# EAGLE schematic Quadcopter_shield (EAGLE 7.3.0)
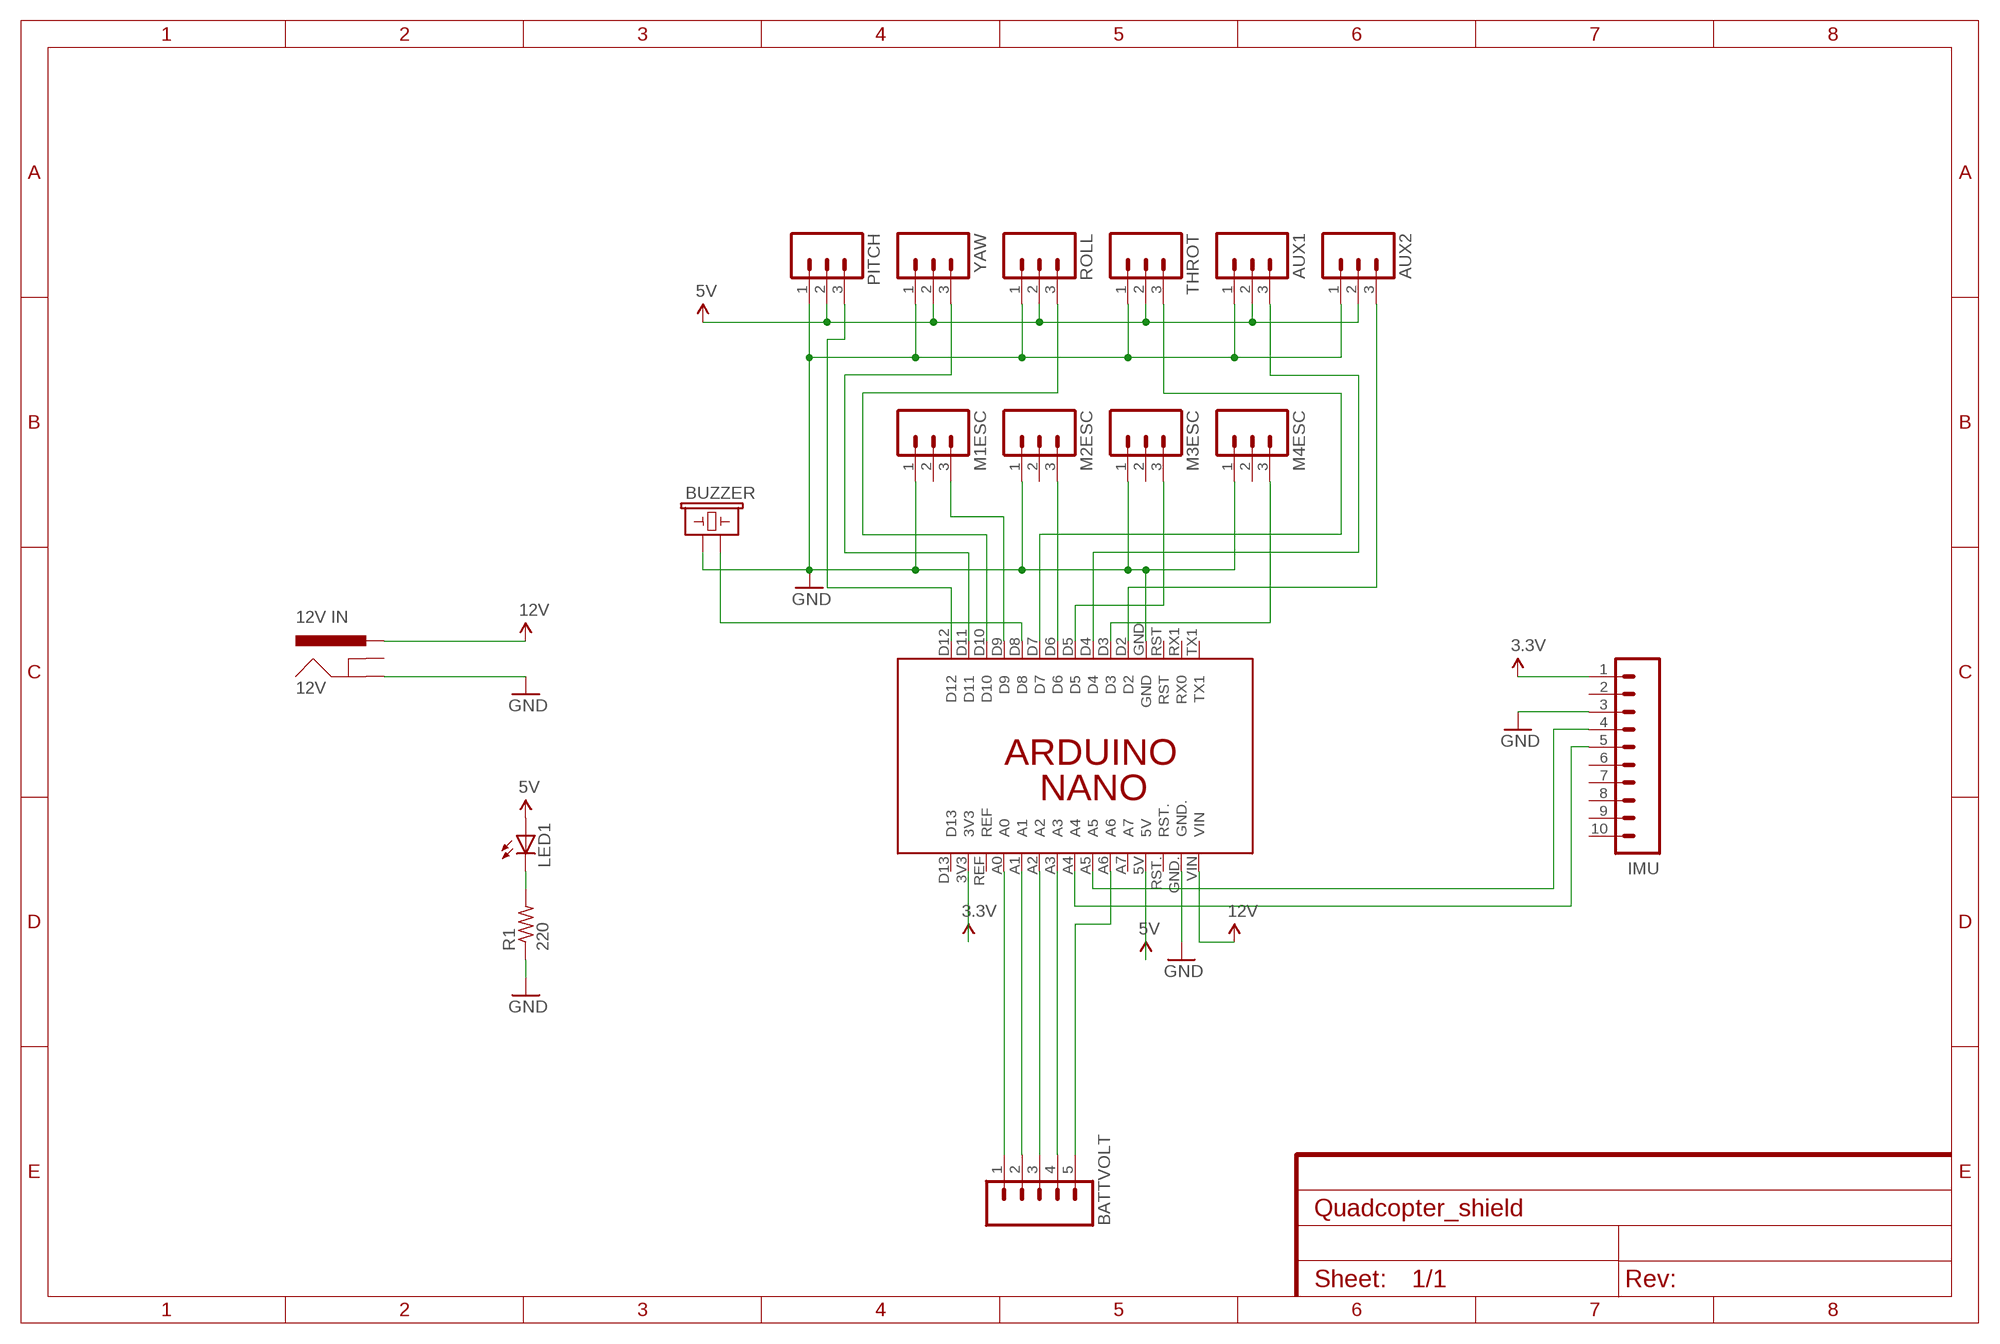
[diagram p0: schematic, sheet 1]

## Parts
12V  12V IN  POWER_JACKPTH_LOCK  [POWER_JACK_PTH_LOCK]
AUX1  M03PTH  [1X03]
AUX2  M03PTH  [1X03]
BATTVOLT  M05PTH  [1X05]
BUZZER  BUZZERNS  [BUZZER-12MM-NS]
IMU  M10SILK_FEMALE_PTH  [1X10]
LED1  TLLR4400  [LED3MM]
M1ESC  M03PTH  [1X03]
M2ESC  M03PTH  [1X03]
M3ESC  M03PTH  [1X03]
M4ESC  M03PTH  [1X03]
PCB1  ARDUINO_NANO  [ARDUINO_NANO]
PITCH  M03PTH  [1X03]
R1  220  R-US_0411/3V  [0411V]
ROLL  M03PTH  [1X03]
THROT  M03PTH  [1X03]
YAW  M03PTH  [1X03]

## Nets
3.3V: IMU.1 PCB1.3V3
5V: AUX1.2 AUX2.2 LED1.A PCB1.5V PITCH.2 ROLL.2 THROT.2 YAW.2
12V: 12V.PWR PCB1.VIN
GND: 12V.GND AUX1.1 AUX2.1 BUZZER.+ IMU.3 M1ESC.1 M2ESC.1 M3ESC.1 M4ESC.1 PCB1.GND PCB1.GND. PITCH.1 R1.1 ROLL.1 THROT.1 YAW.1
N$1: M4ESC.3 PCB1.D3
N$2: M3ESC.3 PCB1.D5
N$3: M2ESC.3 PCB1.D6
N$4: M1ESC.3 PCB1.D9
N$5: IMU.4 PCB1.A5
N$6: IMU.5 PCB1.A4
N$7: BATTVOLT.4 PCB1.A3
N$8: BATTVOLT.3 PCB1.A2
N$9: BATTVOLT.2 PCB1.A1
N$10: BATTVOLT.1 PCB1.A0
N$11: BATTVOLT.5 PCB1.A6
N$12: BUZZER.- PCB1.D8
N$13: AUX2.3 PCB1.D2
N$14: AUX1.3 PCB1.D4
N$15: PCB1.D7 THROT.3
N$16: PCB1.D10 ROLL.3
N$17: PCB1.D11 YAW.3
N$18: PCB1.D12 PITCH.3
N$19: LED1.K(C) R1.2
Unconnected: 12V.GNDBREAK IMU.2 IMU.6 IMU.7 IMU.8 IMU.9 IMU.10 M1ESC.2 M2ESC.2 M3ESC.2 M4ESC.2 PCB1.A7 PCB1.D13 PCB1.REF PCB1.RST PCB1.RST. PCB1.RX1(RX0) PCB1.TX1

## Library data of the parts
12V = SparkFun-Connectors:POWER_JACK: Power Jack This is the standard 5.5mm barrel jack for power. The PTH is the most common, proven, reliable, footprint. The Slot footprint only works if the mill layer is transmitted to the PCB fab house so be warned. Mating wall wart : TOL-00298 (and others); PROD_ID: CONN-08197; SF_ID: PRT-00119
AUX1 AUX2 M1ESC M2ESC M3ESC M4ESC PITCH ROLL THROT YAW = SparkFun-Connectors:M03: Header 3 Standard 3-pin 0.1" header. Use with straight break away headers (SKU : PRT-00116), right angle break away headers (PRT-00553), swiss pins (PRT-00743), machine pins (PRT-00117), and female headers (PRT-00115). Molex polarized connector foot print use with SKU : PRT-08232 with associated crimp pins and housings.
BATTVOLT = SparkFun-Connectors:M05: Header 5 Standard 5-pin 0.1" header. Use with straight break away headers (SKU : PRT-00116), right angle break away headers (PRT-00553), swiss pins (PRT-00743), machine pins (PRT-00117), and female headers (PRT-00115). Molex polarized connector foot print use with SKU : PRT-08230 with associated crimp pins and housings.
BUZZER = SparkFun-Electromechanical:BUZZER: Buzzer 12mm Spark Fun Electronics SKU : Comp-Buzzer
IMU = SparkFun-Connectors:M10: Header 10 Standard 10-pin 0.1" header. Use with straight break away headers (SKU : PRT-00116), right angle break away headers (PRT-00553), swiss pins (PRT-00743), machine pins (PRT-00117), and female headers (PRT-00115).; PROD_ID: CONN-11563
LED1 = led:TLLR4400: Low Current (2mA) LED 3 mm Tinted Diffused Package color RED Source: Data sheet <http://www.farnell.com/datasheets/391100.pdf>; MF: VISHAY SEMICONDUCTOR; OC_FARNELL: 1612437
PCB1 = E14_Arduino_revC_thebest_nano:ARDUINO_NANO: Device for representing an Arduino Nano board with a footprint in an EAGLE design. Created by Dave Young for Element14. More EAGLE documentation at: http://www.element14.com/community/community/knode/cadsoft_eagle
R1 = resistor:R-US_: RESISTOR, American symbol